# Altium schematic sheet 02-USB Host.SchDoc
size A4; DocumentNumber: 22; SheetNumber: 22; SheetTotal: 34
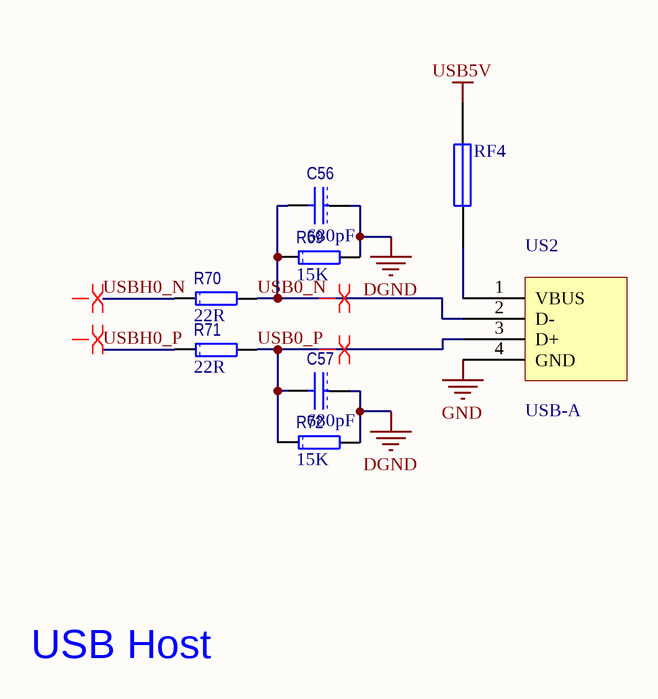
[diagram p0: 02-USB Host.SchDoc]

## Parts
C56  value 680pF  [1608[0603]C]  (hidden comment: C1608X7R1H681K)
C57  value 680pF  [1608[0603]C]  (hidden comment: C1608X7R1H681K)
R69  value 15K  [1608[0603]R]  (hidden comment: CRCW060315K0FKEA)
R70  value 22R  [1608[0603]R]  (hidden comment: CRCW060322R0FKEA)
R71  value 22R  [1608[0603]R]  (hidden comment: CRCW060322R0FKEA)
R72  value 15K  [1608[0603]R]  (hidden comment: CRCW060315K0FKEA)
RF4  0805L050WR  [2012[0805]F]  (value not drawn)
US2  USB-A  [USB2.5-2H4C]

## Nets
DGND: C56.1 C57.1 R69.2 R72.2
GND: US2.4(GND)
USB5V: RF4.2
USB0_N: C56.2 R69.1 R70.2 US2.2(D-)
USB0_P: C57.2 R71.2 R72.1 US2.3(D+)
USBH0_N: R70.1
USBH0_P: R71.1
NetRF4_1: RF4.1 US2.1(VBUS)

## Layout directives
differential pair: (no net found under the mark), USB0_N, USB0_P

## Notes on the sheet
- USB Host

## Library data of the parts
C56 C57 = CAP: 多层陶瓷电容器MLCC - SMD/SMT 0603 50volts 680pF X7R 10%; Manufacturer: TDK; 尺寸: 0.8 mm W x 1.6 mm L; 工作温度范围: - 55 C to + 125 C; 封装 / 箱体: 0603 (1608 metric); 封装: Reel; 产品: General Type MLCCs; 电压额定值: 50 V; 外壳代码 - in: 0603; 外壳代码 - mm: 1608; 产品种类: Low & Medium Capacitance SMD Ceramic Chip Capacitors; 标准包装数量: 4000; Product Status: End of Life; Supplier 1: Mouser; Supplier Part Number 1: 810-C1608X7R1H681K; Manufacturer Part Number: C1608X7R1H681K; RoHS: RoHS Compliant; Description 1: 多层陶瓷电容器MLCC - SMD/SMT 0603 50volts 680pF X7R 10%; Category: 多层陶瓷电容器MLCC - SMD/SMT; Stock 1: 0; Pricing 1: 4000=0.006, 8000=0.005, 20000=0.004 (USD); 电容: 680 pF; 端接类型: SMD/SMT; 容差: 10 %; 制造商: TDK; 温度系数/代码: X7R; RoHS - 贸泽: Y; Minimum Order Quantity: 4000; Reeling: True; ComponentLink1URL: http://www.tdk.com/pdf/general_B11.pdf; ComponentLink1Description: http://www.tdk.com/pdf/general_B11.pdf
R69 R72 = RES: 厚膜电阻器 - SMD 1/10watt 15Kohms 1%; Manufacturer: Vishay / Dale; 尺寸: 0.85 mm W x 1.55 mm L x 0.45 mm H; 工作温度范围: - 55 C to + 155 C; 封装 / 箱体: 0603 (1608 metric); 封装: Reel; 功率额定值: 100 mW; 产品: Thick Film Resistors SMD; 系列: CRCW; 温度系数: 100 PPM / K; 端接类型: SMD/SMT; 电压额定值: 75 V; 外壳代码 - in: 0603; 外壳代码 - mm: 1608; 制造商: Vishay; 产品种类: 0603 Thick Film Chip Resistors; 标准包装数量: 5000; Supplier 1: Mouser; Supplier Part Number 1: 71-CRCW0603-15K-E3; Manufacturer Part Number: CRCW060315K0FKEA; RoHS: RoHS Compliant By Exemption; Description 1: 厚膜电阻器 - SMD 1/10watt 15Kohms 1%; Category: 厚膜电阻器 - SMD; Stock 1: 75064; Pricing 1: 1=0.080, 10=0.013, 100=0.010, 1000=0.008, 5000=0.005, 25000=0.004, 50000=0.003 (USD); 电阻: 15 kOhms; 容差: 1 %; RoHS - 贸泽: E; Minimum Order Quantity: 1; Reeling: True; ComponentLink1URL: http://www.mouser.com/ds/2/427/dcrcwe3-109170.pdf; ComponentLink1Description: http://www.mouser.com/ds/2/427/dcrcwe3-109170.pdf
R70 R71 = RES: 厚膜电阻器 - SMD 1/10watt 22ohms 1%; Manufacturer: Vishay / Dale; 尺寸: 0.85 mm W x 1.55 mm L x 0.45 mm H; 工作温度范围: - 55 C to + 155 C; 封装 / 箱体: 0603 (1608 metric); 封装: Reel; 功率额定值: 100 mW; 产品: Thick Film Resistors SMD; 系列: CRCW; 温度系数: 100 PPM / K; 端接类型: SMD/SMT; 电压额定值: 75 V; 制造商: Vishay; 标准包装数量: 5000; 外壳代码 - in: 0603; 外壳代码 - mm: 1608; 产品种类: 0603 Thick Film Chip Resistors; Supplier 1: Mouser; Supplier Part Number 1: 71-CRCW0603-22-E3; Manufacturer Part Number: CRCW060322R0FKEA; RoHS: RoHS Compliant By Exemption; Category: 厚膜电阻器 - SMD; Stock 1: 35802; 电阻: 22 Ohms; 容差: 1 %; Minimum Order Quantity: 1; Reeling: True; ComponentLink1URL: http://www.mouser.com/ds/2/427/dcrcwe3-109170.pdf; ComponentLink1Description: http://www.mouser.com/ds/2/427/dcrcwe3-109170.pdf; Description 1: 厚膜电阻器 - SMD 1/10watt 22ohms 1%; Pricing 1: 1=0.080, 10=0.013, 100=0.010, 1000=0.008, 5000=0.005, 25000=0.004, 50000=0.003 (USD); RoHS - 贸泽: E
RF4 = FUSE1: 可复位保险丝 PTC 30V POLY SURF MOUNT 0805 .500A; Manufacturer: Littelfuse; Resistance: 850 mOhms; Current Rating (Max): 100 A; Hold Current: 0.5 A; Maximum Voltage: 6 VDC; Trip Current: 1 A; Supplier 1: Mouser; Supplier Part Number 1: 576-0805L050; Manufacturer Part Number: 0805L050WR; RoHS: RoHS Compliant; Category: Resettable Fuses - PPTC; Stock 1: 4103; Pricing 1: 1=3.25, 10=2.61, 50=2.39, 100=2.12, 200=2.07, 500=1.74, 1000=1.49, 3000=1.40, 6000=1.35 (AUD); Dimensions: 2.2 mm L x 1.5 mm W x 1.25 mm  H; Operating Temperature Range: - 40 C to + 85 C; Package / Case: 0805 (2012 metric); Packaging: Reel; Series: 0805L; Termination Style: SMD/SMT; Type: PolyFuse Resettable PTC; Mounting Style: SMD/SMT; Product Category: Resettable PTCs; Standard Pack Qty: 3000; RoHS - Mouser: Y; Minimum Order Quantity: 1; Reeling: True; ComponentLink1URL: http://www.mouser.com/ds/2/240/Littelfuse_0805L-32472.pdf; ComponentLink1Description: http://www.mouser.com/ds/2/240/Littelfuse_0805L-32472.pdf
US2 = USBPORT: IC